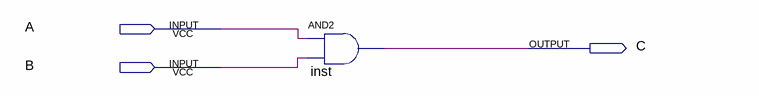
[diagram p0: schematic sheet]
// Quartus schematic projeto_aula00.bdf as structural Verilog: 1 symbols, 3 pins
module projeto_aula00 (
  input  A,
  input  B,
  output C
);

  and inst (C, A, B);
endmodule
